# Altium project MB1363.PrjPcb (part 4 of 4)
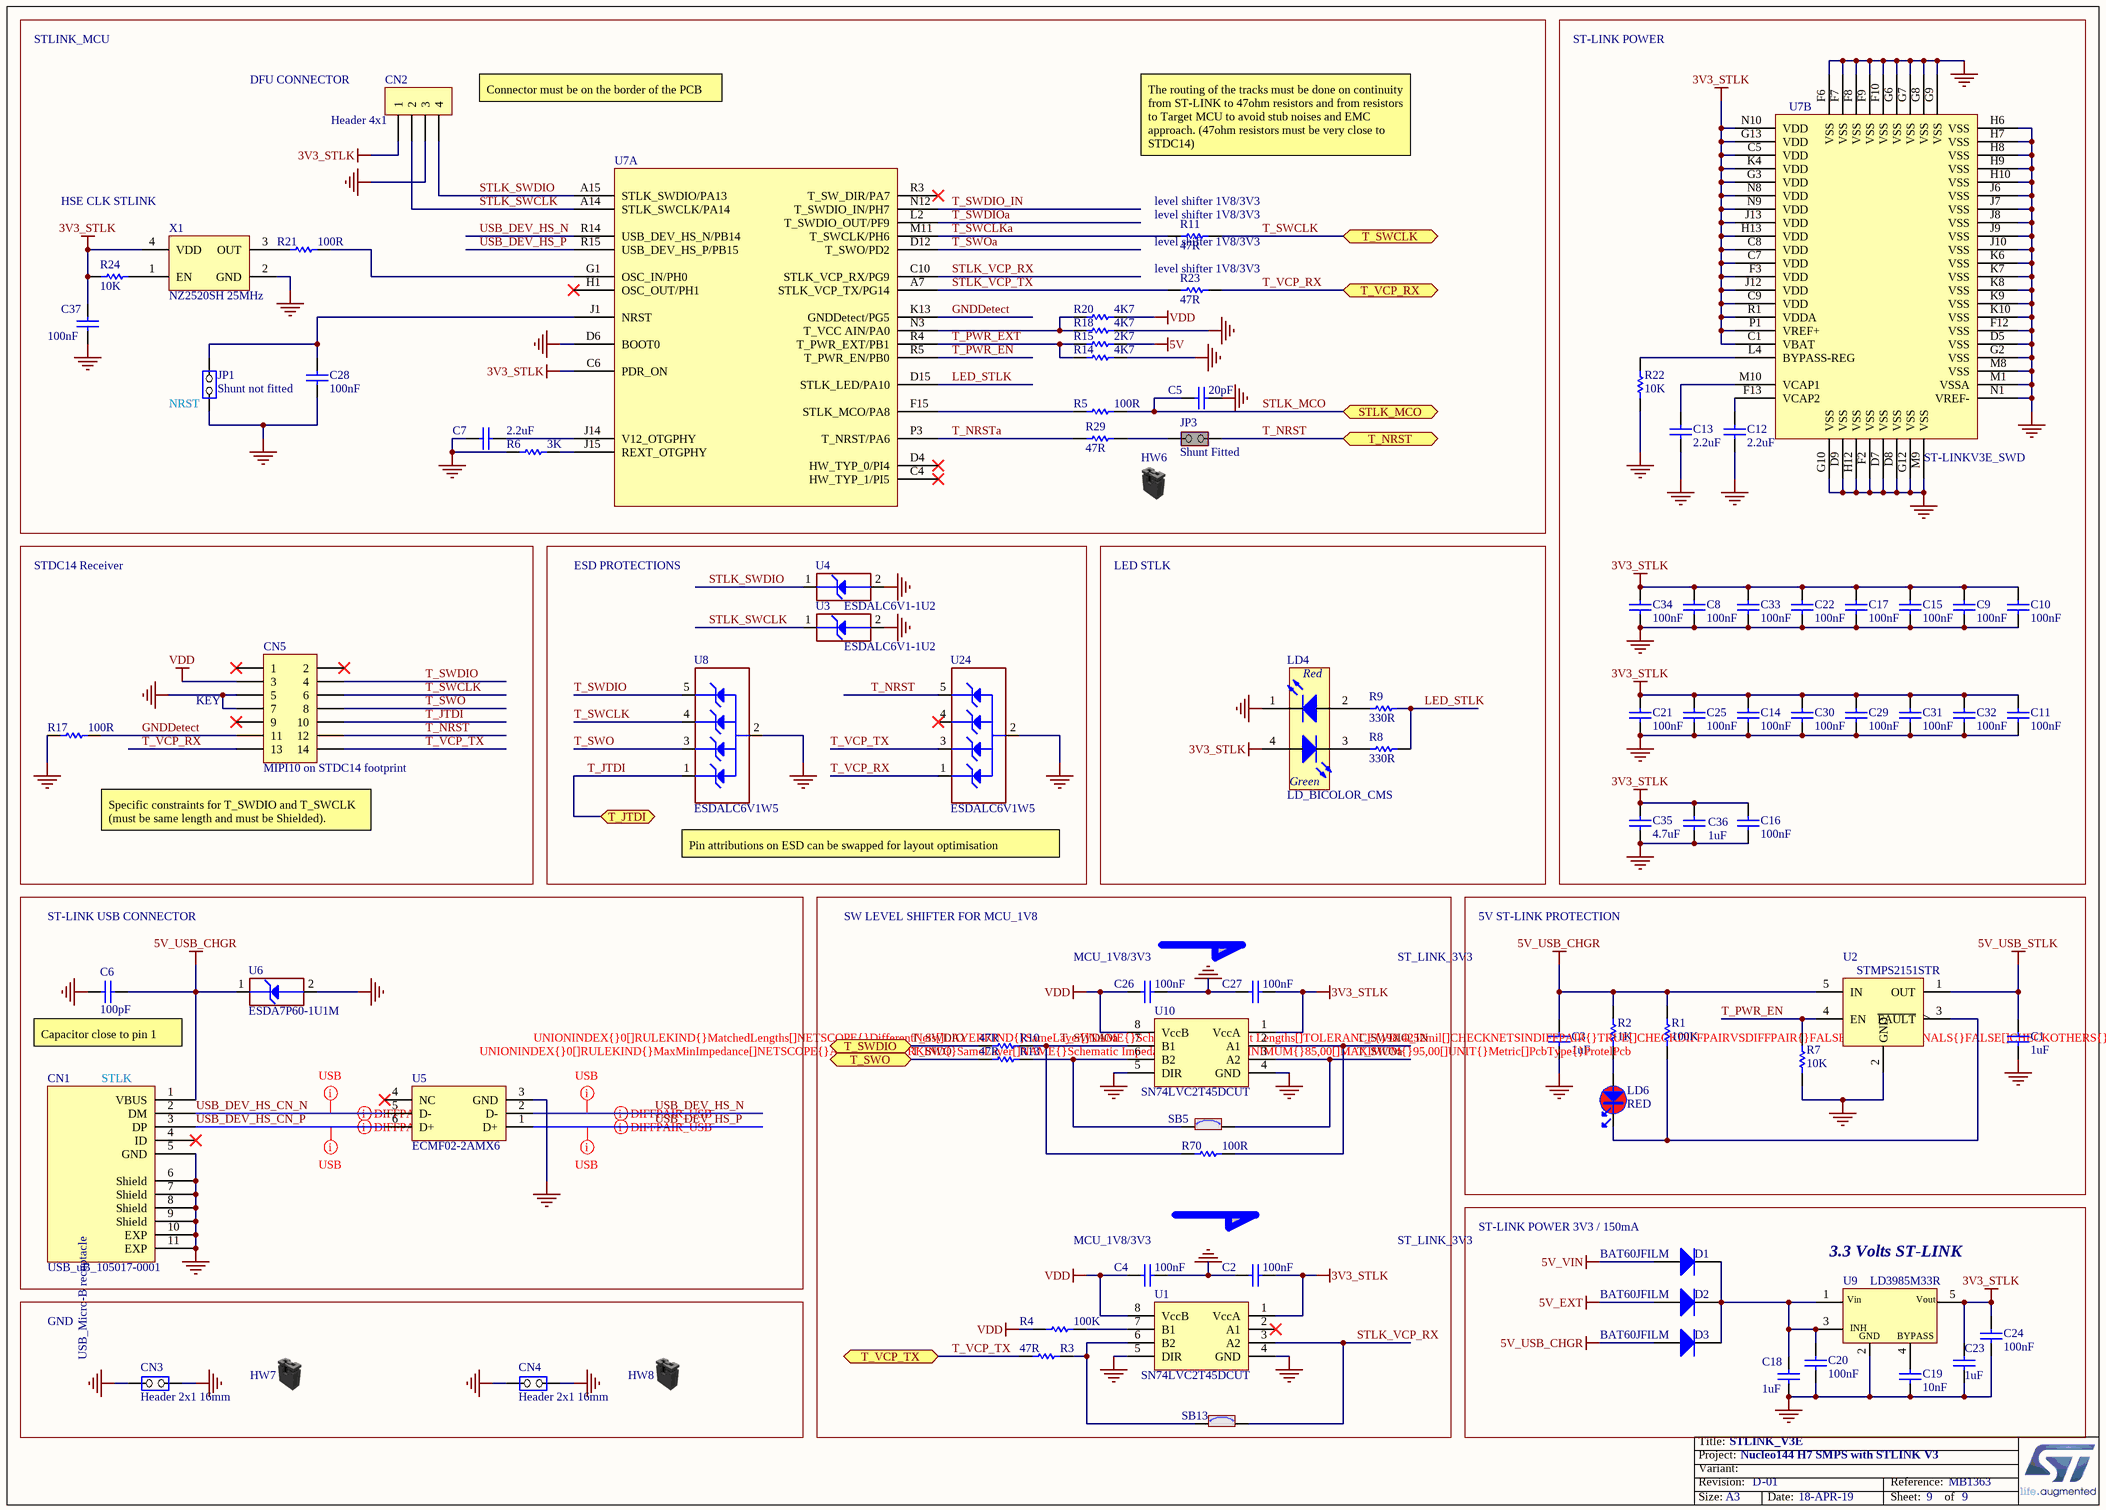
[diagram p9: ST_LINK_V3E.SchDoc]

## Nets that join several sheets
1V2_MCU: Connectors (SB95.2), MCU_144_POWER (SB75.2 SB76.2 SB79.1)
3V3: Connectors (7 pins), Power_Board (JP5.1 SB2.2 SB6.1 TP1.1), MCU_144_POWER (SB18.2 SB19.2), USB (R59.2 R68.2 R69.2), Ethernet (L2.2)
5V: Connectors (CN8.9 CN11.18), Power_Board (8 pins), USB (U18.5), ST_LINK_V3E (R15.1)
5V_EXT: Connectors (CN11.6), Power_Board (JP2.5), ST_LINK_V3E (D2.1)
5V_USB_CHGR: Power_Board (JP2.7), ST_LINK_V3E (8 pins)
5V_USB_STLK: Connectors (CN12.8), Power_Board (JP2.1), ST_LINK_V3E (C1.2 U2.1)
5V_VIN: Power_Board (C41.2 JP2.3 U12.2 U12.4), ST_LINK_V3E (D1.1)
AGND: Connectors (C70.1 CN10.3 CN12.32), MCU_144_POWER (6 pins)
GND: Connectors (31 pins), Power_Board (15 pins), MCU_144_IOs (15 pins), MCU_144_POWER (39 pins), USB (13 pins), Ethernet (22 pins), ST_LINK_V3E (111 pins)
VBAT: Connectors (CN11.33), MCU_144_POWER (C63.2 SB83.2 U14.8)
VDD: Connectors (CN11.5 SB14.1), Power_Board (JP5.2 SB97.2), MCU_144_IOs (B1.1 B1.2), MCU_144_POWER (JP4.1), USB (R64.2), Ethernet (7 pins), ST_LINK_V3E (7 pins)
VDD_MCU: MCU_144_IOs (R37.2), MCU_144_POWER (30 pins)
VDDA: Connectors (CN10.1), MCU_144_POWER (6 pins)
VIN: Connectors (CN8.15 CN11.24), Power_Board (C42.2 U12.3)
VOUTVDD: Connectors (CN6.3), Power_Board (SB97.1)
VREFP: Connectors (C70.2 SB60.2), MCU_144_POWER (C69.1 C71.2 R39.2 U14.35)
ARD_D0_RX: Connectors (CN10.16), MCU_144_IOs (SB94.2 SB96.1)
ARD_D1_TX: Connectors (CN10.14), MCU_144_IOs (SB11.1 SB15.2)
BOOT0: Connectors (CN11.7), MCU_144_IOs (R36.1 U14.135)
NRST: Connectors (CN8.5 CN11.14), MCU_144_IOs (5 pins), Ethernet (SB98.1)
PA0: Connectors (CN11.28 SB89.1), MCU_144_IOs (SB81.2 U14.37)
PA1: Connectors (CN11.30), MCU_144_IOs (SB80.1 U14.38)
PA2: Connectors (CN12.35 SB78.1), MCU_144_IOs (JP7.2 U14.39)
PA3: Connectors (CN9.1 CN12.37), MCU_144_IOs (U14.40)
PA4: Connectors (CN7.17 CN11.32 SB77.1), MCU_144_IOs (U14.43)
PA5: Connectors (CN7.10 CN12.11 SB65.1), MCU_144_IOs (U14.44)
PA6: Connectors (CN7.12 CN12.13), MCU_144_IOs (U14.45)
PA7: Connectors (CN12.15 SB56.2), MCU_144_IOs (SB52.1 U14.46)
PA8: Connectors (CN12.23 SB28.2), MCU_144_IOs (TP4.1 U14.97)
PA9: Connectors (CN12.21), MCU_144_IOs (SB21.1 U14.98)
PA10: Connectors (CN12.33), MCU_144_IOs (SB29.1 U14.99)
PA11: Connectors (SB22.1), MCU_144_IOs (SB26.1 U14.100)
PA12: Connectors (SB23.1), MCU_144_IOs (SB27.1 U14.101)
PA13: Connectors (CN11.13), MCU_144_IOs (U14.102)
PA14: Connectors (CN11.15), MCU_144_IOs (U14.107)
PA15: Connectors (CN7.9 CN11.17), MCU_144_IOs (U14.108), ST_LINK_V3E (CN5.10 U8.1)
PB0: Connectors (CN10.31 CN11.34 SB54.1), MCU_144_IOs (U14.49)
PB1: Connectors (CN9.7 CN12.24), MCU_144_IOs (U14.50)
PB2: Connectors (CN12.22 SB44.1 SB51.1), MCU_144_IOs (U14.51)
PB3: Connectors (CN12.31 SB49.1), MCU_144_IOs (SB50.2 U14.130)
PB4: Connectors (CN7.19 CN12.27), MCU_144_IOs (U14.131)
PB5: Connectors (SB53.1 SB55.1 SB57.2 SB59.1), MCU_144_IOs (U14.132)
PB6: Connectors (CN12.17), MCU_144_IOs (SB11.2 SB12.2 U14.133)
PB7: Connectors (CN11.21), MCU_144_IOs (SB64.2 SB96.2 U14.134)
PB8: Connectors (CN7.2 CN12.3 SB39.1), MCU_144_IOs (U14.136)
PB9: Connectors (CN7.4 CN12.5 SB62.1), MCU_144_IOs (U14.137)
PB10: Connectors (CN10.32 CN12.25), MCU_144_IOs (U14.66)
PB11: Connectors (CN10.34 CN12.18), MCU_144_IOs (U14.67)
PB12: Connectors (CN7.7 CN12.16), MCU_144_IOs (U14.72)
PB13: Connectors (SB8.1 SB43.1), MCU_144_IOs (JP6.1 U14.73)
PB14: Connectors (CN9.29 R75.1 SB37.1), MCU_144_IOs (U14.74)
PB15: Connectors (CN7.3 CN12.26), MCU_144_IOs (U14.75)
PC0: Connectors (CN9.3 CN11.38), MCU_144_IOs (U14.28)
PC1: Connectors (CN11.36 SB70.1), MCU_144_IOs (SB84.2 U14.29)
PC2: Connectors (CN11.35 SB69.1), MCU_144_IOs (U14.30)
PC3: Connectors (CN9.5 CN11.37), MCU_144_IOs (U14.31)
PC4: Connectors (CN12.34), MCU_144_IOs (SB63.2 U14.47)
PC5: Connectors (CN12.6 SB58.1), MCU_144_IOs (SB48.2 U14.48)
PC6: Connectors (CN7.1 CN12.4), MCU_144_IOs (U14.93)
PC7: Connectors (CN7.11 CN12.19), MCU_144_IOs (U14.94)
PC8: Connectors (CN8.2 SB20.2), MCU_144_IOs (U14.95)
PC9: Connectors (CN8.4 SB9.1), MCU_144_IOs (U14.96)
PC10: Connectors (CN8.6 CN11.1), MCU_144_IOs (U14.109)
PC11: Connectors (CN8.8 CN11.2), MCU_144_IOs (U14.110)
PC12: Connectors (CN8.10 CN11.3), MCU_144_IOs (U14.111)
PC13: Connectors (CN11.23), MCU_144_IOs (SB82.2 U14.9)
PD0: Connectors (CN9.25 CN11.57), MCU_144_IOs (U14.112)
PD1: Connectors (CN9.27 CN11.55), MCU_144_IOs (U14.113)
PD2: Connectors (CN8.12 CN11.4), MCU_144_IOs (U14.114)
PD3: Connectors (CN9.10 CN11.40), MCU_144_IOs (U14.115)
PD4: Connectors (CN9.8 CN11.39), MCU_144_IOs (U14.116)
PD5: Connectors (CN9.6 CN11.41), MCU_144_IOs (U14.117)
PD6: Connectors (CN9.4 CN11.43), MCU_144_IOs (U14.120)
PD7: Connectors (CN9.2 CN11.45), MCU_144_IOs (U14.121)
PD8: Connectors (CN12.10), MCU_144_IOs (SB103.1)
PD9: Connectors (CN11.69), MCU_144_IOs (SB104.1)
PD10: Connectors (CN12.65 SB99.2), MCU_144_IOs (JP8.2 U14.78)
PD11: Connectors (CN10.23 CN12.45), MCU_144_IOs (U14.81)
PD12: Connectors (CN10.21 CN12.43), MCU_144_IOs (U14.82)
PD13: Connectors (CN10.19 CN12.41), MCU_144_IOs (U14.83)
PD14: Connectors (CN7.16 CN12.46), MCU_144_IOs (U14.84)
PD15: Connectors (CN7.18 CN12.48), MCU_144_IOs (U14.85)
PE0: Connectors (CN10.33 CN12.64), MCU_144_IOs (U14.138)
PE1: Connectors (CN11.61 R74.1), MCU_144_IOs (U14.139)
PE2: Connectors (CN11.46 SB87.1 SB88.2), MCU_144_IOs (U14.1)
PE3: Connectors (CN9.22 CN11.47), MCU_144_IOs (U14.2)
PE4: Connectors (CN9.16 CN11.48), MCU_144_IOs (U14.3)
PE5: Connectors (CN9.18 CN11.50), MCU_144_IOs (U14.4)
PE6: Connectors (CN11.62 SB10.1 SB85.2 SB86.2), MCU_144_IOs (U14.5)
PE7: Connectors (CN10.20 CN12.44), MCU_144_IOs (U14.57)
PE8: Connectors (CN10.18 CN12.40 SB47.1), MCU_144_IOs (U14.58)
PE9: Connectors (CN9.15 CN12.52), MCU_144_IOs (U14.59)
PE10: Connectors (CN10.24 CN12.47), MCU_144_IOs (U14.60)
PE11: Connectors (CN10.6 CN12.56), MCU_144_IOs (U14.61)
PE12: Connectors (CN10.26 CN12.49), MCU_144_IOs (U14.62)
PE13: Connectors (CN10.10 CN12.55), MCU_144_IOs (U14.63)
PE14: Connectors (CN10.8 CN12.51), MCU_144_IOs (U14.64)
PE15: Connectors (CN10.30 CN12.53 SB38.1), MCU_144_IOs (U14.65)
PF6: Connectors (CN11.9 SB73.1), MCU_144_IOs (U14.20)
PF7: Connectors (CN9.26 CN11.11), MCU_144_IOs (U14.21)
PF8: Connectors (CN9.24 CN11.54), MCU_144_IOs (U14.22)
PF9: Connectors (CN9.28 CN11.56), MCU_144_IOs (U14.23)
PF10: Connectors (CN12.42 SB93.1), MCU_144_IOs (SB91.1 U14.24)
PF11: Connectors (CN12.62 SB40.1), MCU_144_IOs (U14.52)
PF14: Connectors (CN9.19 CN12.50), MCU_144_IOs (U14.53)
PF15: Connectors (CN9.21 CN12.60), MCU_144_IOs (U14.54)
PG6: Connectors (CN10.13 CN12.70), MCU_144_IOs (U14.86)
PG7: Connectors (CN12.67), MCU_144_IOs (SB100.2 U14.87)
PG8: Connectors (CN12.66 SB31.2 SB34.2), MCU_144_IOs (U14.88)
PG9: Connectors (CN11.63 SB35.2 SB41.2), MCU_144_IOs (U14.122)
PG10: Connectors (CN11.66 SB30.2 SB33.2), MCU_144_IOs (U14.123)
PG11: Connectors (CN11.70), MCU_144_IOs (SB36.2 U14.124)
PG12: Connectors (CN11.65 SB42.2 SB45.2), MCU_144_IOs (U14.125)
PG13: Connectors (CN11.68), MCU_144_IOs (SB46.2 U14.126)
PG14: Connectors (CN10.12 CN12.61), MCU_144_IOs (U14.127)
RMII_CRS_DV: MCU_144_IOs (SB52.2), Ethernet (R44.1)
RMII_MDC: MCU_144_IOs (SB84.1), Ethernet (U15.13)
RMII_MDIO: MCU_144_IOs (JP7.1), Ethernet (R50.1 U15.12)
RMII_REF_CLK: MCU_144_IOs (SB80.2), Ethernet (R52.1)
RMII_RXD0: MCU_144_IOs (SB63.1), Ethernet (R47.1)
RMII_RXD1: MCU_144_IOs (SB48.1), Ethernet (R48.1)
RMII_TX_EN: MCU_144_IOs (SB36.1), Ethernet (U15.16)
RMII_TXD0: MCU_144_IOs (SB46.1), Ethernet (U15.17)
RMII_TXD1: MCU_144_IOs (JP6.2), Ethernet (U15.18)
STLK_MCO: MCU_144_IOs (SB72.2), ST_LINK_V3E (C5.2 R5.2)
T_VCP_RX: MCU_144_IOs (SB17.2 SB64.1), ST_LINK_V3E (CN5.13 R23.2 U24.1)
T_VCP_TX: MCU_144_IOs (SB12.1 SB16.2), ST_LINK_V3E (CN5.14 R3.1 U24.3)
USB_FS_ID: MCU_144_IOs (SB29.2), USB (CN13.4 U22.1)
USB_FS_N: MCU_144_IOs (SB26.2), USB (U19.1)
USB_FS_OVCR: MCU_144_IOs (SB100.1), USB (LD7.2 R64.1 U18.3)
USB_FS_P: MCU_144_IOs (SB27.2), USB (U19.3)
USB_FS_PWR_EN: MCU_144_IOs (JP8.1 SB91.2), USB (R59.1 U18.4)
USB_FS_VBUS: MCU_144_IOs (R63.1), USB (5 pins)

## Assembly variants
H745ZIQ: not fitted C61 C62 C74 C76 C77 C78 CN2 CN6 CN11 CN12 R33 R34 R38 R57 R58 R70 SB3 SB4 SB5 SB8 SB9 SB10 SB12 SB13 SB15 SB20 SB22 SB23 SB24 SB25 SB38 SB39 SB44 SB47 SB55 SB56 SB58 SB62 SB64 SB65 SB66 SB67 SB70 SB71 SB74 SB77 SB78 SB81 SB90 SB91 SB94 SB95 SB97 SB99 SB101 SB102 X2
H755ZIQ: not fitted C61 C62 C74 C76 C77 C78 CN2 CN6 CN11 CN12 R33 R34 R38 R57 R58 R70 SB3 SB4 SB5 SB8 SB9 SB10 SB12 SB13 SB15 SB20 SB22 SB23 SB24 SB25 SB38 SB39 SB44 SB47 SB55 SB56 SB58 SB62 SB64 SB65 SB66 SB67 SB70 SB71 SB74 SB77 SB78 SB81 SB90 SB91 SB94 SB95 SB97 SB99 SB101 SB102 X2
H7A3ZIQ: not fitted C61 C62 C74 C76 C77 C78 C79 C80 C81 C82 C83 C84 C85 C86 C87 C88 C89 C90 CN2 CN6 CN11 CN12 CN14 HW3 HW14 HW15 JP6 JP7 JP8 L2 R33 R34 R38 R43 R44 R45 R46 R47 R48 R49 R50 R51 R52 R53 R54 R55 R56 R57 R58 R60 R61 R62 R70 R78 R79 R80 R81 SB3 SB4 SB5 SB9 SB10 SB12 SB13 SB15 SB20 SB22 SB23 SB24 SB25 SB36 SB38 SB39 SB44 SB46 SB47 SB48 SB52 SB55 SB57 SB62 SB63 SB64 SB65 SB66 SB67 SB71 SB73 SB74 SB77 SB80 SB81 SB84 SB90 SB93 SB94 SB95 SB97 SB98 SB101 SB102 U15 U16 U17 X2 X4